# Altium schematic sheet Telemetry_AnalogSensors_PTC08_Shifter.SchDoc
size A
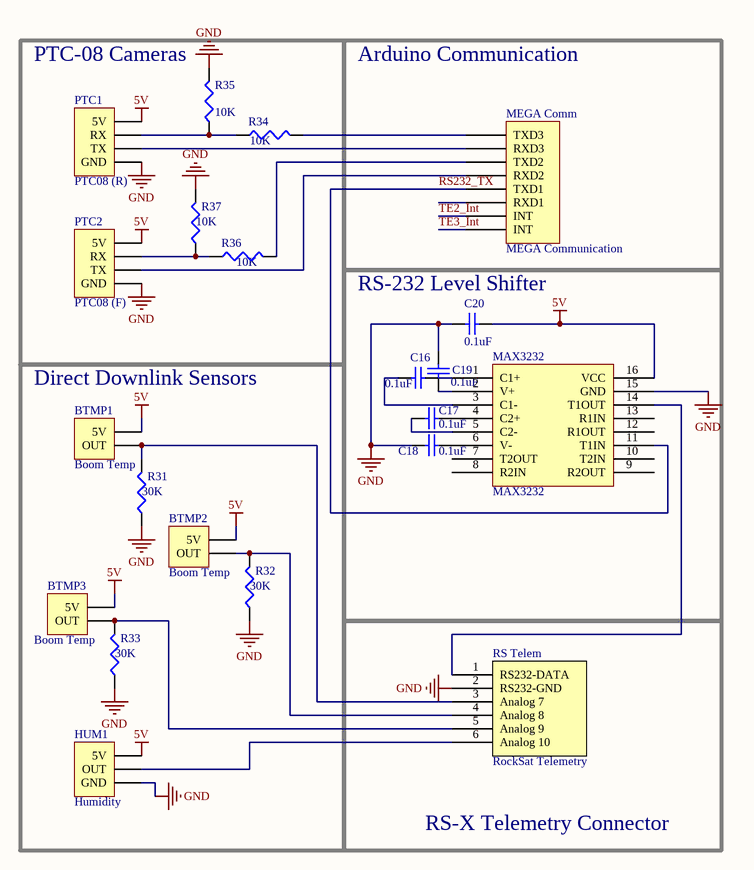
[diagram p0: Telemetry_AnalogSensors_PTC08_Shifter.SchDoc]

## Parts
BTMP1  Boom Temp  [HDR1X2]
BTMP2  Boom Temp  [HDR1X2]
BTMP3  Boom Temp  [HDR1X2]
C16  0.1uF  [C1206]
C17  0.1uF  [C1206]
C18  0.1uF  [C1206]
C19  0.1uF  [C1206]
C20  0.1uF  [C1206]
HUM1  Humidity  [HDR1X3]
MAX3232  MAX3232  [rs232]
MEGA_Comm  MEGA Communication  [HDR1X8]
PTC1  PTC08 (R)  [HDR1X4]
PTC2  PTC08 (F)  [HDR1X4]
R31  30K  [J1-0603]
R32  30K  [J1-0603]
R33  30K  [J1-0603]
R34  10K  [J1-0603]
R35  10K  [J1-0603]
R36  10K  [J1-0603]
R37  10K  [J1-0603]
RS_Telem  RockSat Telemetry  [HDR1X6]

## Blocks framed on the sheet
PTC-08 Cameras: PTC1 PTC2 R34-R37
Arduino Communication: MEGA_Comm
RS-232 Level Shifter: C16-C20 MAX3232
Direct Downlink Sensors: BTMP1-BTMP3 HUM1 R31-R33
RS-X Telemetry Connector: RS_Telem

## Nets
5V: BTMP1.1(5V) BTMP2.1(5V) BTMP3.1(5V) C20.1 HUM1.3(5V) MAX3232.16(VCC) PTC1.1(5V) PTC2.1(5V)
GND: C18.1 C19.2 C20.2 HUM1.1(GND) MAX3232.15(GND) PTC1.4(GND) PTC2.4(GND) R31.1 R32.1 R33.1 R35.2 R37.2 RS_Telem.2(RS232-GND)
RS232_TX: MAX3232.11(T1IN) MEGA_Comm.5(TXD1)
TE2_Int: MEGA_Comm.7(INT)
TE3_Int: MEGA_Comm.8(INT)
NetBTMP1_2: BTMP1.2(OUT) R31.2 RS_Telem.3(Analog_7)
NetBTMP2_2: BTMP2.2(OUT) R32.2 RS_Telem.4(Analog_8)
NetBTMP3_2: BTMP3.2(OUT) R33.2 RS_Telem.5(Analog_9)
NetC16_1: C16.1 MAX3232.1(C1+)
NetC16_2: C16.2 MAX3232.3(C1-)
NetC17_1: C17.1 MAX3232.4(C2+)
NetC17_2: C17.2 MAX3232.5(C2-)
NetC18_2: C18.2 MAX3232.6(V-)
NetC19_1: C19.1 MAX3232.2(V+)
NetHUM1_2: HUM1.2(OUT) RS_Telem.6(Analog_10)
NetMAX3232_14: MAX3232.14(T1OUT) RS_Telem.1(RS232-DATA)
NetMEGA_Comm_1: MEGA_Comm.1(TXD3) R34.2
NetMEGA_Comm_2: MEGA_Comm.2(RXD3) PTC1.3(TX)
NetMEGA_Comm_3: MEGA_Comm.3(TXD2) R36.2
NetMEGA_Comm_4: MEGA_Comm.4(RXD2) PTC2.3(TX)
NetPTC1_2: PTC1.2(RX) R34.1 R35.1
NetPTC2_2: PTC2.2(RX) R36.1 R37.1

Not connected (* = marked no-connect by the designer): MAX3232 7(T2OUT) 8(R2IN) 9(R2OUT) 10(T2IN) 12(R1OUT) 13(R1IN); MEGA_Comm 6(RXD1)

## Library data of the parts
BTMP1-BTMP3 = Header 2: Header, 2-Pin; LatestRevisionDate: 17-Jul-2002; LatestRevisionNote: Re-released for DXP Platform.; Publisher: Altium Limited
C16-C20 = Cap Semi: Capacitor (Semiconductor SIM Model); Published: 8-Jun-2000; LatestRevisionDate: 29-May-2009; LatestRevisionNote: IPC-7351 Footprint Added.; PackageReference: C1206; Publisher: Altium Limited; PackageDescription: Chip Capacitor; Value: 0.1uF
HUM1 = Header 3: Header, 3-Pin; LatestRevisionDate: 17-Jul-2002; LatestRevisionNote: Re-released for DXP Platform.; Publisher: Altium Limited
MEGA_Comm RS_Telem = Component_1
PTC1 PTC2 = Header 4: Header, 4-Pin; LatestRevisionDate: 17-Jul-2002; LatestRevisionNote: Re-released for DXP Platform.; Publisher: Altium Limited
R31-R37 = Res3: Resistor; Published: 8-Jun-2000; LatestRevisionDate: 29-May-2009; LatestRevisionNote: IPC-7351 Footprint Added.; PackageReference: J1-0603; Publisher: Altium Limited; PackageDescription: Chip Resistor
  R31-R33: Value: 30K
  R34-R37: Value: 10K